# EAGLE design SomTest1 (EAGLE 9.4.0)
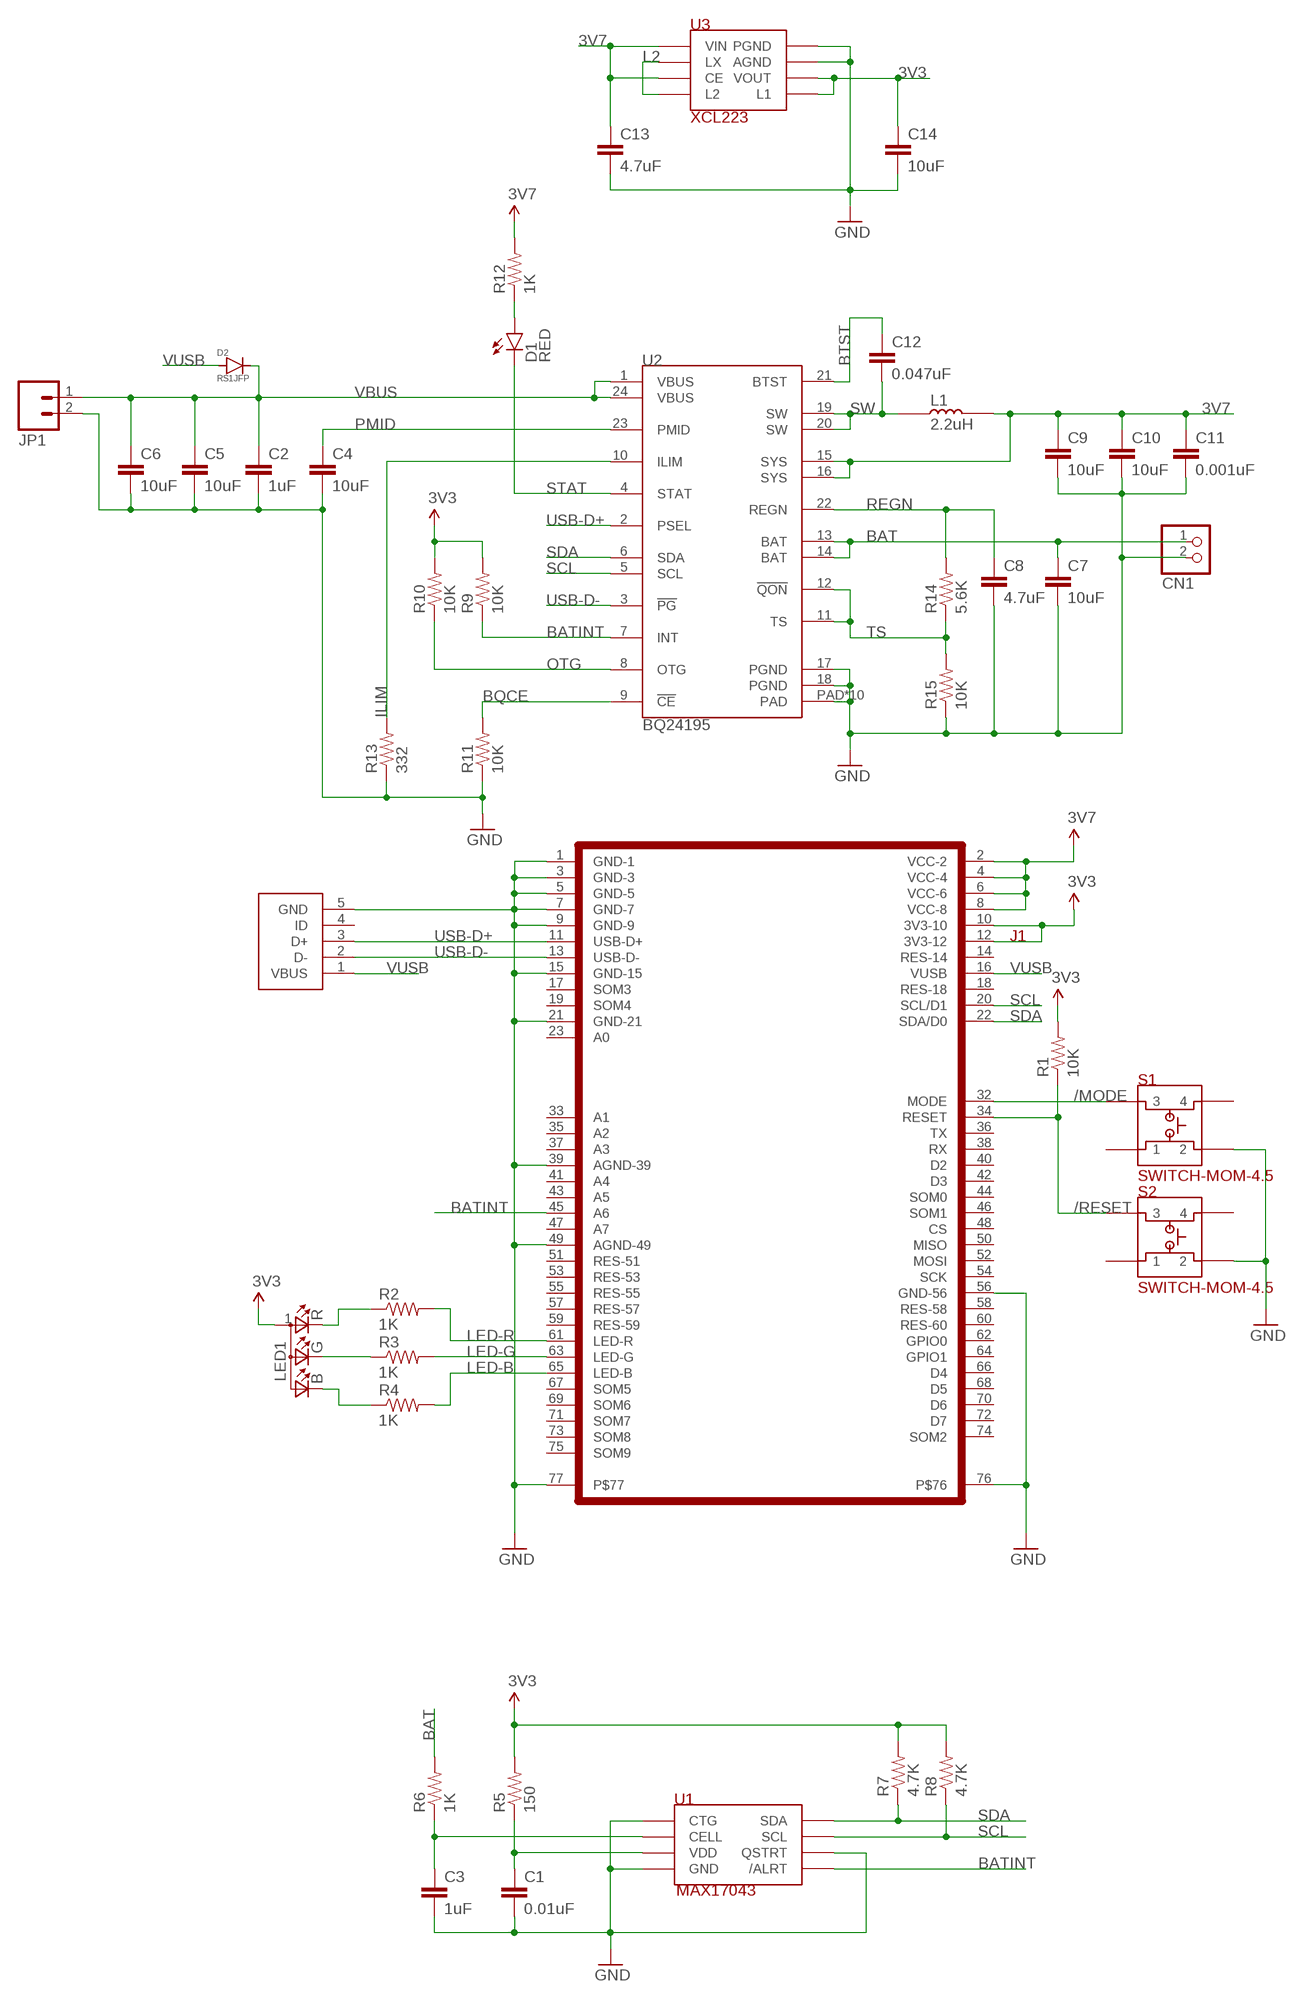
[diagram p0: schematic, sheet 1]

## Parts
C1  0.01uF  CAP-0.01UF-0603  [0603-CAP]
C2  1uF  CAP-1UF-0603.DEV  [0603-CAP]
C3  1uF  CAP-1UF-0603.DEV  [0603-CAP]
C4  10uF  CAP-10UF-0603  [0603-CAP]
C5  10uF  CAP-10UF-0603  [0603-CAP]
C6  10uF  CAP-10UF-0603  [0603-CAP]
C7  10uF  CAP-10UF-0603  [0603-CAP]
C8  4.7uF  CAP-4.7UF-0603  [0603-CAP]
C9  10uF  CAP-10UF-0603  [0603-CAP]
C10  10uF  CAP-10UF-0603  [0603-CAP]
C11  0.001uF  CAP-0.001UF-0603  [0603-CAP]
C12  0.047uF  CAP-0.047UF-0603  [0603-CAP]
C13  4.7uF  CAP-4.7UF-0603  [0603-CAP]
C14  10uF  CAP-10UF-0603  [0603-CAP]
CN1  JST_2PIN-THM  [JST-PH-2-THM]
D1  RED  LED-RED  [LED-0603]
D2  RS1JFP  DIODE-RS1JFP  [SOD-123HE-ON]
J1  SPARK_M.2EKEY  [SPARK_M.2EKEY-LESS-CREAM]
JP1  M02PTH  [1X02]
L1  2.2uH  INDUCTOR-2.2UH  [1008-BOURNS]
LED1  LED-RGB-CREE-SMD  [LED-RGB-CREE-SMD]
R1  10K  RES-10K-06030603  [0603-RES]
R2  1K  RES-1K-0603  [0603-RES]
R3  1K  RES-1K-0603  [0603-RES]
R4  1K  RES-1K-0603  [0603-RES]
R5  150  RES-150-0603  [0603-RES]
R6  1K  RES-1K-0603  [0603-RES]
R7  4.7K  RES-4.7K-0603  [0603-RES]
R8  4.7K  RES-4.7K-0603  [0603-RES]
R9  10K  RES-10K-06030603  [0603-RES]
R10  10K  RES-10K-06030603  [0603-RES]
R11  10K  RES-10K-06030603  [0603-RES]
R12  1K  RES-1K-0603  [0603-RES]
R13  332  RES-332-0603.DEV  [0603-RES]
R14  5.6K  RES-5.6K-0603  [0603-RES]
R15  10K  RES-10K-06030603  [0603-RES]
S1  SWITCH-MOM-4.5  [SWITCH-MOM-4.5]
S2  SWITCH-MOM-4.5  [SWITCH-MOM-4.5]
U1  MAX17043  [9UCSP-MAXIM]
U2  BQ24195  [24VFQN-TI]
U3  XCL223  REG-XCL223  [REG-XCL223-LESS-CREAM]
U$3  USB-MICRO-B-SOCKET-AMPHENOL  [USB-B-SMT-AMPHENOL]

## Nets
3V3: C14.1 J1.10(3V3-10) J1.12(3V3-12) LED1.1(A) R1.2 R5.2 R7.2 R8.2 R9.2 R10.2 U3.3(VOUT) U3.7(L1)
3V7: C9.1 C10.1 C11.1 C13.1 J1.2(VCC-2) J1.4(VCC-4) J1.6(VCC-6) J1.8(VCC-8) L1.2 R12.2 U2.15(SYS) U2.16(SYS) U3.4(CE) U3.6(VIN)
/MODE: J1.32(MODE) S1.3
/RESET: J1.34(RESET) R1.1 S2.3
BAT: C7.1 CN1.1 R6.2 U2.13(BAT) U2.14(BAT)
BATINT: J1.45(A6) R9.1 U1.C1(/ALRT) U2.7(INT)
BQCE: R11.2 U2.9(!CE)
BTST: C12.1 U2.21(BTST)
GND: C1.2 C2.2 C3.2 C4.2 C5.2 C6.2 C7.2 C8.2 C9.2 C10.2 C11.2 C13.2 C14.2 CN1.2 J1.1(GND-1) J1.3(GND-3) J1.5(GND-5) J1.7(GND-7) J1.9(GND-9) J1.15(GND-15) J1.21(GND-21) J1.39(AGND-39) J1.49(AGND-49) J1.56(GND-56) J1.76 J1.77 JP1.2 R11.1 R13.1 R15.1 S1.2 S2.2 U1.A3(CTG) U1.B1(QSTRT) U1.C3(GND) U2.17(PGND) U2.18(PGND) U2.PAD U2.PAD@1(PAD) U2.PAD@2(PAD) U2.PAD@3(PAD) U2.PAD@4(PAD) U2.PAD@5(PAD) U2.PAD@6(PAD) U2.PAD@7(PAD) U2.PAD@8(PAD) U2.PAD@9(PAD) U3.1(PGND) U3.2(AGND) U$3.5(GND)
ILIM: R13.2 U2.10(ILIM)
L2: U3.5(LX) U3.8(L2)
LED-B: J1.65(LED-B) R4.2
LED-G: J1.63(LED-G) R3.2
LED-R: J1.61(LED-R) R2.2
N$2: LED1.3(G) R3.1
N$3: C3.1 R6.1 U1.B3(CELL)
N$5: C1.1 R5.1 U1.C2(VDD)
N$6: LED1.4(R) R2.1
N$7: D1.A R12.1
N$10: LED1.2(B) R4.1
OTG: R10.1 U2.8(OTG)
PMID: C4.1 U2.23(PMID)
REGN: C8.1 R14.2 U2.22(REGN)
SCL: J1.20(SCL/D1) R8.1 U1.A2(SCL) U2.5(SCL)
SDA: J1.22(SDA/D0) R7.1 U1.A1(SDA) U2.6(SDA)
STAT: D1.C U2.4(STAT)
SW: C12.2 L1.1 U2.19(SW) U2.20(SW)
TS: R14.1 R15.2 U2.11(TS) U2.12(!QON)
USB-D+: J1.11(USB-D+) U2.2(PSEL) U$3.3(D+)
USB-D-: J1.13(USB-D-) U2.3(!PG) U$3.2(D-)
VBUS: C2.1 C5.1 C6.1 D2.1(CATHODE) JP1.1 U2.1(VBUS) U2.24(VBUS)
VUSB: D2.2(ANODE) J1.16(VUSB) U$3.1(VBUS)
Unconnected: J1.14(RES-14) J1.17(SOM3) J1.18(RES-18) J1.19(SOM4) J1.23(A0) J1.33(A1) J1.35(A2) J1.36(TX) J1.37(A3) J1.38(RX) J1.40(D2) J1.41(A4) J1.42(D3) J1.43(A5) J1.44(SOM0) J1.46(SOM1) J1.47(A7) J1.48(CS) J1.50(MISO) J1.51(RES-51) J1.52(MOSI) J1.53(RES-53) J1.54(SCK) J1.55(RES-55) J1.57(RES-57) J1.58(RES-58) J1.59(RES-59) J1.60(RES-60) J1.62(GPIO0) J1.64(GPIO1) J1.66(D4) J1.67(SOM5) J1.68(D5) J1.69(SOM6) J1.70(D6) J1.71(SOM7) J1.72(D7) J1.73(SOM8) J1.74(SOM2) J1.75(SOM9) S1.1 S1.4 S2.1 S2.4 U$3.4(ID)

## Library data of the parts
C1 = rickk2:CAP-0.01UF-0603: CAP CER 10000PF 100V X7R 0603 10000 pF = 10 nF = 0.01 uF https://www.digikey.com/product-detail/en/murata-electronics-north-america/GCM188R72A103KA37J/490-8028-1-ND/4380313
C2 C3 = rickk2:CAP-1UF-0603.DEV: CAP CER 1UF 25V X7R 0603 $ 0.10 Samsung CL10B105KA8NNNC https://www.digikey.com/product-detail/en/samsung-electro-mechanics-america-inc/CL10B105KA8NNNC/1276-1184-1-ND/3889270 1µF ±10% 25V Ceramic Capacitor X7R 0603 (1608 Metric)
C4-C7 C9 C10 C14 = rickk2:CAP-10UF-0603: CAP CER 10UF 16V X5R 0805 $ 0.21 https://www.digikey.com/product-detail/en/murata-electronics-north-america/GRM21BR61C106KE15L/490-3886-1-ND/965928
C8 C13 = rickk2:CAP-4.7UF-0603: Murata X5R series CAP CER 4.7UF 6.3V X5R 0603 $0.12 https://www.digikey.com/product-detail/en/murata-electronics-north-america/GRM188R60J475KE19J/490-6407-1-ND/3845604
C11 = rickk2:CAP-0.001UF-0603: 0.001uF / 1 nF / 1000 pF cap $0.10 **not ordered yet** Murata Electronics North America GRM1885C1H102JA01D CAP CER 1000PF 50V C0G/NP0 0603 1000pF ±5% 50V Ceramic Capacitor C0G, NP0 0603 (1608 Metric) https://www.digikey.com/product-detail/en/murata-electronics-north-america/GRM1885C1H102JA01D/490-1451-1-ND/587655
C12 = rickk2:CAP-0.047UF-0603: 0.047uF / 47 nF cap $0.30 **not ordered yet** Murata Electronics North America GCJ188R71H473KA12D CAP CER 0.047UF 50V X7R 0603 0.047µF ±10% 50V Ceramic Capacitor X7R 0603 (1608 Metric) https://www.digikey.com/product-detail/en/murata-electronics-north-america/GCJ188R71H473KA12D/490-5854-1-ND/2785840
CN1 = rickk2:JST_2PIN: JST 2-Pin Connectors of various flavors SMT-RA (S2B-PH-SM4) 4UConnector #17311 SMT (B2B-PH-SM4) THM-RA (S2B-PH) THM (B2B-PH) 1=+ 2=- THM: CONN HEADER PH TOP 2POS 2MM $0.17 B2B-PH-K-S(LF)(SN) https://www.digikey.com/product-detail/en/jst-sales-america-inc/B2B-PH-K-S-LF-SN/455-1704-ND/926611
D1 = rickk2:LED-RED: LED RED CLEAR 0603 SMD $0.41 Red 631nm LED Indication - Discrete 2V 0603 (1608 Metric) 5mA@2V https://www.digikey.com/product-detail/en/lite-on-inc/LTST-C193KRKT-5A/160-1830-1-ND/2356251 Res = 270 ohm @ 3.3V Res = 680 ohm 1/8W @ 5V Res = 2.2K 1/8W @ 12V
D2 = rickk2:DIODE-RS1JFP: Reverse voltage protection diode - not ordered yet! ON Semiconductor RS1JFP $0.44 DIODE GP 600V 1.2A SOD123HE Diode Standard 600V 1.2A Surface Mount SOD-123HE https://www.digikey.com/product-detail/en/on-semiconductor/RS1JFP/RS1JFPCT-ND/5722970 Used in Ford open power supply 1=Cathode=Large Pad=side with band 2=Anode=Small Pad
J1 = rickk2:SPARK_M.2EKEY: $1.42 CONN FEMALE 67POS 0.020 GOLD TE Connectivity AMP Connectors 2199230-4 https://www.digikey.com/product-detail/en/te-connectivity-amp-connectors/2199230-4/A115904CT-ND/4208916
JP1 = rickk2:M02: Standard 2-pin 0.1" header. Use with - straight break away headers ( PRT-00116) - right angle break away headers (PRT-00553) - swiss pins (PRT-00743) - machine pins (PRT-00117) - female headers (PRT-00115) Molex polarized connector foot print use with: PRT-08233 with associated crimp pins and housings. 2.54_SCREWTERM for use with PRT-10571. 3.5mm Screw Terminal footprints for PRT-08084 5mm Screw Terminal footprints for use with PRT-08432
L1 = rickk2:INDUCTOR-2.2UH: 2.2uH inductor $0.31 **not ordered yet** Bourns Inc. SRN2512-2R2M FIXED IND 2.2UH 2.3A 102 MOHM 2.2µH Semi-Shielded Wirewound Inductor 2.3A 102 mOhm Max 1008 (2520 Metric) https://www.digikey.com/product-detail/en/bourns-inc/SRN2512-2R2M/SRN2512-2R2MCT-ND/4867759
LED1 = rickk2:LED-RGB-CREE-SMD: LED RGB DIFFUSED 4SMD $ 0.35 Cree CLMVB-FKA-CFHEHLCBB7A363 2mm 4-PLCC common anode RGB LED https://www.digikey.com/product-detail/en/cree-inc/CLMVB-FKA-CFHEHLCBB7A363/CLMVB-FKA-CFHEHLCBB7A363CT-ND/6138627 Red=68 ohm, Green/Blue=33 ohm @ 3.3V
R1 R9-R11 R15 = rickk2:RES-10K-0603: RES SMD 10K OHM 5% 1/4W 0603 $ 0.10 https://www.digikey.com/product-detail/en/panasonic-electronic-components/ERJ-PA3J103V/P10KBZCT-ND/5036237
R2-R4 R6 R12 = rickk2:RES-1K-0603: RES SMD 1K OHM 0.5% 1/5W 0603 $ 0.17 https://www.digikey.com/product-detail/en/panasonic-electronic-components/ERJ-PB3D1001V/P20283CT-ND/6214538 Panasonic
R5 = rickk2:RES-150-0603: Panasonic Electronic Components ERJ-3EKF1500V $0.10 **not ordered yet** RES SMD 150 OHM 1% 1/10W 0603 150 Ohms ±1% 0.1W, 1/10W Chip Resistor 0603 (1608 Metric) Automotive AEC-Q200 Thick Film https://www.digikey.com/product-detail/en/panasonic-electronic-components/ERJ-3EKF1500V/P150HCT-ND/198177
R7 R8 = rickk2:RES-4.7K-0603: RES SMD 4.7K OHM 5% 1/4W 0603 $ 0.11 https://www.digikey.com/product-detail/en/panasonic-electronic-components/ERJ-PA3J472V/P4.7KBZCT-ND/5036332 Panasonic
R13 = rickk2:RES-332-0603.DEV: Panasonic SMD 0603 1% 1/10W https://www.digikey.com/product-detail/en/panasonic-electronic-components/ERJ-3EKF3320V/P332HCT-ND/198336
R14 = rickk2:RES-5.6K-0603: Panasonic Electronic Components ERJ-3EKF5601V $0.10 **not ordered yet** RES SMD 5.6K OHM 1% 1/10W 0603 5.6 kOhms ±1% 0.1W, 1/10W Chip Resistor 0603 (1608 Metric) Automotive AEC-Q200 Thick Film https://www.digikey.com/product-detail/en/panasonic-electronic-components/ERJ-3EKF5601V/P5.60KHCT-ND/1746792
S1 S2 = rickk2:SWITCH-MOM-4.5: Manufacturer: E-Switch Manufacturer Part Number: TL3305AF160QG Description: SWITCH TACTILE SPST-NO 50MA 12V Detailed Description: Tactile Switch SPST-NO Top Actuated Surface Mount $0.20 https://www.digikey.com/product-detail/en/e-switch/TL3305AF160QG/EG5350CT-ND/5816195
U1 = rickk2:MAX17043: MAX17043X+T10 9-UCSP (W91C1+1) package https://www.mouser.com/ProductDetail/Maxim-Integrated/MAX17043X%2bT10?qs=sGAEpiMZZMtKiEBa%2FXu9%252BOav9R4qKwGZ Connect CTG and QSTRT to GND. /ALRT is output can leave unconnected.
U2 = rickk2:BQ24195: Texas Instruments BQ24195LRGER $2.93 IC CHRG MGMT LI-ION/POL 24VQFN Charger IC Lithium-Ion/Polymer 24-VQFN (4x4) https://www.digikey.com/product-detail/en/texas-instruments/BQ24195LRGER/296-49149-1-ND/9351369
U3 = rickk2:REG-XCL223: Manufacturer: Torex Semiconductor Ltd Manufacturer Part Number: XCL223A333D2-G DC DC CONVERTER 3.3V Detailed Description: Non-Isolated PoL Modul $2.63 https://www.digikey.com/product-detail/en/torex-semiconductor-ltd/XCL223A333D2-G/893-1416-1-ND/8256118 CIN=4.7uF 10V CL = 10uF 10V VIN MAX=5.5V VOUT=3.3V
U$3 = rickk2:USB-MICRO-B-SOCKET-AMPHENOL: CONN USB MICRO B RECPT SMT R/A $0.42 Amphenol FCI 10118194-0001LF https://www.digikey.com/products/en?keywords=609-4618-1-nd

## Board
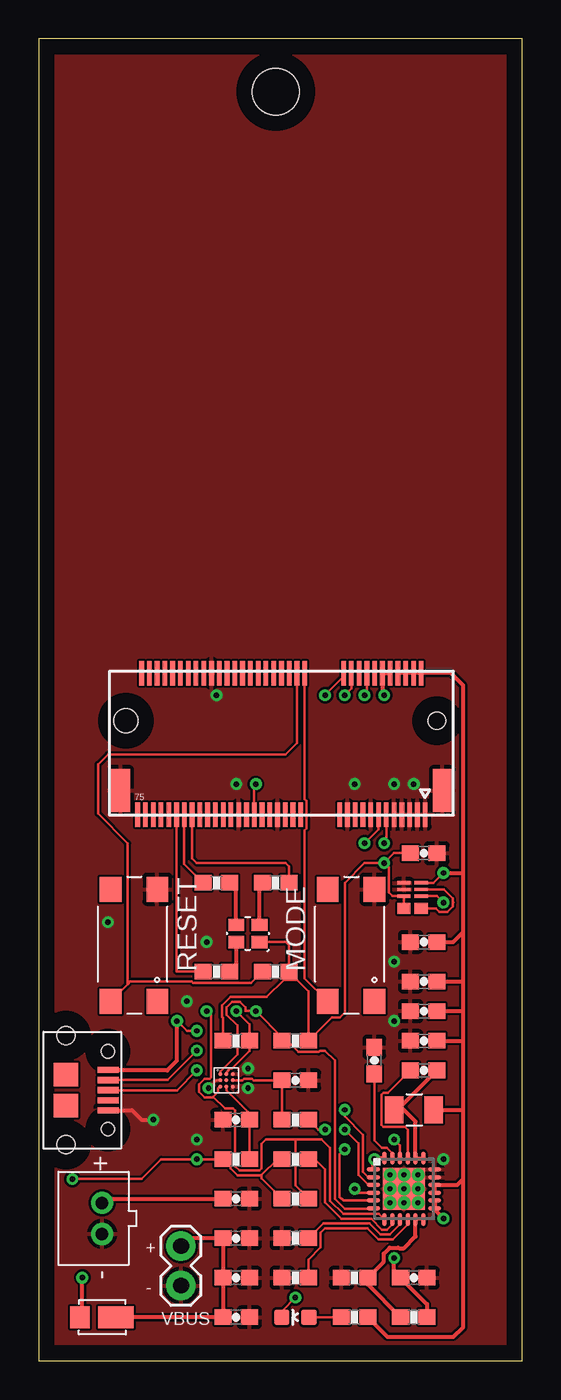
[diagram p1: board, top side]
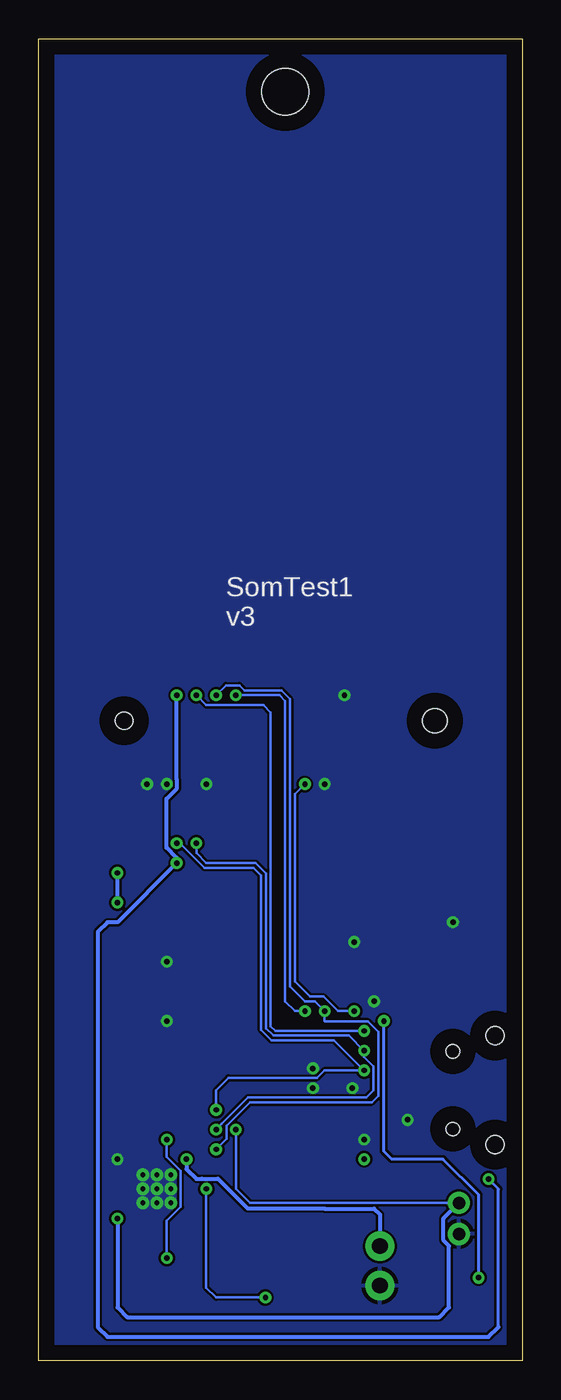
[diagram p2: board, bottom side, seen from below]

Size 31.09 x 85.01 mm. Coordinates in mm from the lower left corner, seen from the top.
Outline: 0,0 31.09,0 31.09,85.01 0,85.01 0,0
Copper layers (1*16): Top 0.035mm / dielectric 1.5mm / Bottom 0.035mm
Design rules "default": minimum track width 6mil, minimum drill 0.35mm, track to track 6mil, track to pad 6mil, pad to pad 6mil, via to via 6mil, smd to smd 6mil, copper to edge 40mil, drill to drill 6mil, minimum pad ring 10mil, minimum via ring 8mil, stop-mask expansion 4mil, vias tented up to drill 0mil, thermal gap 10mil
Holes 3 mm at 15.24,81.62

### Footprints (pad centres in the part's own frame; a part is rotated, then mirrored left to right if it is on the bottom)
0603-CAP = smd 1.1 x 1: 1 -0.85,0; 2 0.85,0
JST-PH-2-THM = drill 0.8 pad 1.422: 1 1,0; 2 -1,0
LED-0603 = smd 1 x 1: A 0,-0.877; C 0,0.877
SOD-123HE-ON = smd 2.3 x 1.4: 1 -0.9,0 | smd 1.25 x 1.4: 2 1.425,0
SPARK_M.2EKEY-LESS-CREAM = smd 0.3 x 1.55: 1 -9.62,4.51; 2 -9.37,-4.59; 3 -9.12,4.51; 4 -8.87,-4.59; 5 -8.62,4.51; 6 -8.37,-4.59; 7 -8.12,4.51; 8 -7.87,-4.59; 9 -7.62,4.51; 10 -7.37,-4.59; 11 -7.12,4.51; 12 -6.87,-4.59; 13 -6.62,4.51; 14 -6.37,-4.59; 15 -6.12,4.51; 16 -5.87,-4.59; 17 -5.62,4.51; 18 -5.37,-4.59; 19 -5.12,4.51; 20 -4.87,-4.59; 21 -4.62,4.51; 22 -4.37,-4.59; 23 -4.12,4.51; 32 -1.87,-4.59; 33 -1.62,4.51; 34 -1.37,-4.59; 35 -1.12,4.51; 36 -0.87,-4.59; 37 -0.62,4.51; 38 -0.37,-4.59; 39 -0.12,4.51; 40 0.13,-4.59; 41 0.38,4.51; 42 0.63,-4.59; 43 0.88,4.51; 44 1.13,-4.59; 45 1.38,4.51; 46 1.63,-4.59; 47 1.88,4.51; 48 2.13,-4.59; 49 2.38,4.51; 50 2.63,-4.59; 51 2.88,4.51; 52 3.13,-4.59; 53 3.38,4.51; 54 3.63,-4.59; 55 3.88,4.51; 56 4.13,-4.59; 57 4.38,4.51; 58 4.63,-4.59; 59 4.88,4.51; 60 5.13,-4.59; 61 5.38,4.51; 62 5.63,-4.59; 63 5.88,4.51; 64 6.13,-4.59; 65 6.38,4.51; 66 6.63,-4.59; 67 6.88,4.51; 68 7.13,-4.59; 69 7.38,4.51; 70 7.63,-4.59; 71 7.88,4.51; 72 8.13,-4.59; 73 8.38,4.51; 74 8.63,-4.59; 75 8.88,4.51 | smd 1.2 x 2.75: 76 9.98,2.96; 77 -10.72,2.96 | hole 1.1: -10.37,-1.54 | hole 1.55: 9.63,-1.54
1X02 = drill 1.016 pad 1.88: 1 0,0; 2 2.54,0
1008-BOURNS = smd 1.2 x 1.75: 1 0,0; 2 2.55,0
LED-RGB-CREE-SMD = smd 1 x 0.8: 1 1.5,0; 2 0,0; 3 0,1.1; 4 1.5,1.1
0603-RES = smd 1.1 x 1: 1 -0.85,0; 2 0.85,0
SWITCH-MOM-4.5 = smd 1.6 x 1.4: 1 0,0; 2 7.2,0; 3 0,3; 4 7.2,3
9UCSP-MAXIM = smd 0.27 x 0.27: A1 -0.4,0.4; A2 0,0.4; A3 0.4,0.4; B1 -0.4,0; B2 0,0; B3 0.4,0; C1 -0.4,-0.4; C2 0,-0.4; C3 0.4,-0.4
24VFQN-TI = smd 0.85 x 0.28: 1 -1.975,1.25; 2 -1.975,0.75; 3 -1.975,0.25; 4 -1.975,-0.25; 5 -1.975,-0.75; 6 -1.975,-1.25; 13 1.975,-1.25; 14 1.975,-0.75; 15 1.975,-0.25; 16 1.975,0.25; 17 1.975,0.75; 18 1.975,1.25 | smd 0.28 x 0.85: 7 -1.25,-1.975; 8 -0.75,-1.975; 9 -0.25,-1.975; 10 0.25,-1.975; 11 0.75,-1.975; 12 1.25,-1.975; 19 1.25,1.975; 20 0.75,1.975; 21 0.25,1.975; 22 -0.25,1.975; 23 -0.75,1.975; 24 -1.25,1.975 | smd 2.7 x 2.7: PAD 0,0 | drill 0.3 pad 0.406: PAD@1 -0.9,0.9; PAD@2 0,0.9; PAD@3 0.9,0.9; PAD@4 -0.9,0; PAD@5 0,0; PAD@6 0.9,0; PAD@7 -0.9,-0.9; PAD@8 0,-0.9; PAD@9 0.9,-0.9
REG-XCL223-LESS-CREAM = smd 0.85 x 0.21: 1 0,0; 2 0,0.43; 3 0,0.86; 4 -1.11,0.86; 5 -1.11,0.43; 6 -1.11,0 | smd 0.85 x 0.7: 7 0,1.655; 8 -1.11,1.655
USB-B-SMT-AMPHENOL = smd 0.4 x 1.35: 1 -1.3,0; 2 -0.65,0; 3 0,0; 4 0.65,0; 5 1.3,0 | smd 1.5 x 1.55: P$6 -1,-2.7; P$7 1,-2.7 | hole 0.85: -2.5,0; 2.5,0 | hole 1.15: -3.5,-2.7; 3.5,-2.7

### Placement (x,y rotation side)
C1  12.7,15.49 180 top
C2  12.7,5.33 0 top
C3  16.51,18.03 0 top
C4  21.59,19.3 90 top
C5  12.7,2.79 0 top
C6  12.7,7.87 0 top
C7  12.7,10.41 0 top
C8  24.13,5.33 0 top
C9  24.77,24.38 180 top
C10  24.77,22.48 180 top
C11  24.77,20.57 180 top
C12  24.77,18.67 0 top
C13  24.77,26.92 180 top
C14  24.77,32.64 0 top
CN1  4.06,9.14 90 top
D1  16.51,2.79 90 top
D2  4.06,2.79 180 top
J1  15.24,39.62 180 top
JP1  9.14,7.37 270 top
L1  22.86,16.13 0 top
LED1  12.7,26.92 0 top
R1  15.24,25.02 0 top
R2  15.24,30.73 0 top
R3  11.43,30.73 180 top
R4  11.43,25.02 180 top
R5  12.7,12.95 180 top
R6  16.51,15.49 0 top
R7  16.51,20.57 0 top
R8  12.7,20.57 180 top
R9  16.51,10.41 180 top
R10  16.51,12.95 180 top
R11  16.51,7.87 0 top
R12  20.32,2.79 0 top
R13  16.51,5.33 0 top
R14  24.13,2.79 0 top
R15  20.32,5.33 0 top
S1  21.59,23.11 90 top
S2  7.62,23.11 90 top
U1  12.06,18.03 0 top
U2  23.5,11.05 0 top
U3  23.5,30.73 180 top
U$3  4.45,17.4 270 top

### Tracks (layer width: path | path; a pad name or v marks a point on that pad's centre or on a via)
3V3  (via drill 0.35)
  Top 0.152: LED1.1 15.88,26.92 16.09,26.71 R1.2 16.62,24.49 | 16.62,24.49 17.36,23.75 R7.2 18.87,22.09 19.39,22.09 19.68,22.39 19.68,30.73 20.95,32 v22.23,32 | 16.62,24.49 15.77,24.49 14.67,23.39 12.32,23.39 11.79,22.86 11.79,22.1 11.85,22.04 R8.2 | v22.23,32 22.86,32.64 C14.1 | U3.7 U3.3 22.74,29.87 22.52,30.1 22.52,31.71 v22.23,32 | R10.2 15.35,12.95 14.35,11.94 | 14.35,11.94 14.32,11.92 12.78,11.92 12.32,12.38 12.32,12.48 R5.2 v10.16,12.95 7.87,12.95 6.6,11.68 v2.16,11.68 | R9.2 14.35,11.73 14.35,11.94
  Top 0.254: v22.23,42.8 22.11,42.91 J1.12 J1.10
  Bottom 0.203: 1.52,2.16 1.52,11.05 v2.16,11.68
  Bottom 0.254: v22.23,42.8 22.23,37.38 22.2,37.36 22.2,36.81 22.88,36.13 22.88,33 22.23,32.34 v22.23,32 26.04,28.19 26.67,28.19 27.3,27.56 27.3,2.16 26.67,1.52 2.16,1.52 1.52,2.16
3V7  (via drill 0.35)
  Top 0.152: U3.4 25.62,29.87 v26.04,29.46 | U3.6 25.4,30.73 v26.04,31.37
  Top 0.254: 27.3,27.56 27.3,31.37 | 27.3,31.37 27.3,43.43 26.52,44.21 J1.2 J1.4 J1.6 J1.8 | C13.1 26.67,26.92 27.3,27.56 | v26.04,31.37 27.3,31.37 | U2.15 U2.16 26.92,11.3 27.3,11.68 | 27.3,11.68 27.3,16.13 | 27.3,16.13 27.3,20.57 | 27.3,20.57 27.3,22.48 | 27.3,22.48 27.3,24.38 | 27.3,24.38 27.3,27.56 | C9.1 27.3,24.38 | C10.1 27.3,22.48 | C11.1 27.3,20.57 | L1.2 27.3,16.13 | R12.2 22.44,1.52 26.67,1.52 27.3,2.16 27.3,11.68
  Bottom 0.254: v26.04,29.46 v26.04,31.37
/MODE
  Top 0.152: S1.3 17.11,24.59 17.11,34.12 17.24,34.24 17.24,35.98 17.11,36.11 J1.32
/RESET
  Top 0.152: 5.71,24.21 5.71,33.27 3.81,35.18 3.81,38.35 4.45,38.99 15.88,38.99 16.61,39.72 J1.34 | 5.71,24.21 5.89,24.38 9.84,24.38 9.94,24.29 13.66,24.29 R1.1 | S2.3 5.71,24.21
BAT  (via drill 0.35)
  Top 0.152: v18.41,14.86 18,14.86 R6.2
  Top 0.254: CN1.1 4.33,10.41 C7.1 | U2.14 U2.13 25.47,9.71 v26.04,9.14
  Bottom 0.152: v18.41,14.86 18.41,11.05 17.51,10.14 CN1.1
  Bottom 0.254: v26.04,9.14 26.04,3.43 25.4,2.79 5.33,2.79 4.7,3.43 4.7,7.38 5.05,7.73 5.05,9.15 CN1.1
BATINT  (via drill 0.35)
  Top 0.152: 11.22,16.97 11.53,17.28 11.53,17.5 U1.C1 | 11.22,16.97 11.17,16.92 10.67,16.92 10.31,17.28 10.31,17.78 10.67,18.13 10.98,18.13 11.07,18.23 11.07,22.2 v10.79,22.48 | 11.22,16.97 11.97,16.22 12.49,16.22 12.63,16.09 12.63,12.5 12.9,12.22 14.2,12.22 14.33,12.36 14.33,13.95 14.61,14.22 16.51,14.22 | 16.51,14.22 18.19,14.22 18.75,13.67 18.75,10.29 19.6,9.43 21.89,9.43 U2.7 | R9.1 16.51,11.26 16.51,14.22 | J1.45 13.86,36.97 v13.97,37.08
  Bottom 0.152: v10.79,22.48 11.84,22.48 12.78,23.42 13.64,23.42 14.61,24.38 14.61,36.45 v13.97,37.08
BQCE
  Top 0.152: R11.2 18.31,8.82 21.26,8.82 21.97,8.12 22.59,8.12 23.25,8.77 U2.9
BTST
  Top 0.152: U2.21 23.75,14.83 23.55,15.03 22.16,15.03 22.03,15.16 22.03,17.1 22.16,17.23 22.48,17.23 C12.1
GND  (via drill 0.35)
  Top 0.152: v10.92,17.53 11.43,18.03 U1.B1
  Top 0.254: U$3.5 6,16.1 6.6,15.49 v7.37,15.49
  other vias: 22.86,37.08 4.45,28.19 10.79,26.92 11.43,42.8 24.13,37.08 20.32,37.08 9.53,23.11 13.46,18.8 13.46,17.53 26.04,12.95 22.86,21.84 22.86,25.65 10.16,14.22 12.7,37.08
  pour Top: 0,-0.76 0,87.12 32.26,87.12 32.26,-0.76
  pour Bottom: 0,-2.29 0,86.36 32.26,86.36 32.26,-2.29
ILIM
  Top 0.152: R13.2 17.36,6.5 18.14,7.28 18.14,8.22 18.43,8.51 21.14,8.51 21.84,7.81 22.79,7.81 23.75,8.77 U2.10
L2
  Top 0.152: U3.8 25.56,29.08 25.78,28.86 26.29,28.86 26.64,29.21 26.64,29.44 26.67,29.46 26.64,29.49 26.64,29.71 26.05,30.3 U3.5
LED-B
  Top 0.152: R4.2 8.89,25.02 8.86,25.05 J1.65
LED-G
  Top 0.152: R3.2 9.36,31.95 J1.63
LED-R
  Top 0.152: R2.2 16.09,31.79 15.88,32 10.16,32 9.86,32.3 J1.61
N$2
  Top 0.254: LED1.3 12.7,30.31 R3.1
N$3
  Top 0.152: U1.B3 13.11,18.03 13.21,18.13 13.71,18.13 13.81,18.03 C3.1 R6.1
N$5
  Top 0.152: U1.C2 12.06,17.4 13.55,15.91 C1.1 R5.1
N$6
  Top 0.254: LED1.4 14.2,30.54 R2.1
N$7
  Top 0.152: D1.A R12.1
N$10
  Top 0.254: LED1.2 12.7,25.44 R4.1
OTG
  Top 0.152: U2.8 22.75,8.77 22.4,8.42 22.09,8.42 21.39,9.13 19.48,9.13 18.41,10.19 18.41,12.32 17.78,12.95 R10.1
PMID
  Top 0.152: C4.1 21.59,14.18 22.09,13.68 22.4,13.68 22.75,13.33 U2.23
REGN  (via drill 0.35)
  Top 0.152: U2.22 23.25,13.84 v22.86,14.22
  Top 0.254: v22.86,6.6 22.86,5.75 C8.1 24.98,3.63 R14.2
  Bottom 0.152: v22.86,6.6 22.86,8.99 21.96,9.89 21.96,12.21 22.86,13.11 v22.86,14.22
SCL  (via drill 0.35)
  Top 0.152: v12.7,22.48 13.55,21.63 R8.1 13.55,19.92 12.43,18.8 12.31,18.8 12.1,18.59 12.1,18.47 U1.A2 | v19.68,13.59 19.36,13.26 19.36,10.54 19.6,10.3 U2.5 | J1.20 20.11,43.22 v19.68,42.8
  Bottom 0.152: v19.68,13.59 19.02,14.25 19.02,15.11 17.52,16.61 9.68,16.61 9.25,17.04 9.25,21.16 9.91,21.82 12.67,21.82 12.7,21.84 v12.7,22.48 13.34,23.11 13.97,23.11 14.94,24.08 14.94,42.54 15.49,43.1 17.86,43.1 18.19,43.43 19.05,43.43 v19.68,42.8
SDA  (via drill 0.35)
  Top 0.152: U1.A1 11.7,18.47 11.7,18.62 12.77,19.69 12.77,21.55 12.09,22.23 12.09,22.73 12.45,23.09 12.95,23.09 13.31,22.73 13.31,22.51 13.34,22.48 v13.97,22.48 15.66,20.79 R7.1 15.99,20.57 16.71,19.85 18,19.85 18.1,19.94 18.41,19.94 19.05,19.3 19.05,10.41 19.68,9.78 21.5,9.78 U2.6 | J1.22 19.61,43.99 v18.41,42.8
  Bottom 0.152: v13.97,22.48 14.61,22.48 15.24,23.11 15.24,42.42 15.62,42.8 v18.41,42.8
STAT  (via drill 0.35)
  Top 0.152: U2.4 20.57,10.8 v20.32,11.05 | D1.C 15.63,3.19 v16.51,4.06
  Bottom 0.152: v16.51,4.06 19.68,4.06 20.32,4.7 v20.32,11.05
SW
  Top 0.254: U2.19 U2.20 24.25,15.38 23.5,16.13 L1.1 23.07,16.13 C12.2
TS
  Top 0.152: U2.11 U2.12
  Top 0.254: R14.1 21.17,4.9 R15.2 22.2,6.37 22.2,6.88 22.59,7.26 23.13,7.26 23.16,7.24 23.5,7.24 24.25,7.99 U2.11
USB-D+  (via drill 0.35)
  Top 0.152: J1.11 22.36,33.41 v22.23,33.27 | U$3.3 8.89,17.4 v10.16,18.67 | U2.2 21.21,11.8 20.87,12.15 20.87,14.54 19.68,15.72 v19.68,16.13
  Bottom 0.152: v22.23,33.27 22.02,33.27 20.45,31.7 17.27,31.7 16.79,31.21 16.79,21.26 16.13,20.6 12.09,20.6 v10.16,18.67 12.73,18.67 13.21,18.19 18.89,18.19 19.68,17.4 v19.68,16.13
USB-D-  (via drill 0.35)
  Top 0.152: J1.13 21.86,34.18 v20.95,33.27 | U$3.2 8.27,18.05 v10.16,19.94 | U2.3 21.21,11.3 20.56,11.95 20.56,13.98 v19.68,14.86
  Bottom 0.152: v20.95,33.27 20.95,32.64 20.32,32 17.14,32 16.48,31.34 16.48,21.39 16,20.9 11.12,20.9 v10.16,19.94 10.16,19.53 9.55,18.92 9.55,17.37 10.01,16.92 17.64,16.92 19.33,15.24 19.33,15.22 v19.68,14.86
VBUS  (via drill 0.35)
  Top 0.254: U2.24 21.66,13.02 v21.59,12.95 21.52,12.88 U2.1 | D2.1 C5.1 C2.1 C6.1 9.65,7.87 JP1.1
  Bottom 0.254: v21.59,12.95 21.59,12.32 20.95,11.68 20.61,11.68 20.59,11.71 19.58,11.71 17.66,9.79 12.71,9.79 12.7,9.78 9.53,9.78 9.14,9.4 JP1.1
VUSB  (via drill 0.35)
  Top 0.152: v20.95,42.8 21.11,42.95 J1.16 | v10.16,21.21 9.53,21.21 v8.89,21.84
  Top 0.254: D2.2 2.79,2.95 v2.79,5.33 | U$3.1 8.22,18.7 8.26,18.67 8.89,19.3 v8.89,21.84
  Bottom 0.152: v10.16,21.21 15.88,21.21 16.18,21.51 16.18,41.7 16.64,42.16 20.32,42.16 v20.95,42.8
  Bottom 0.203: v2.79,5.33 2.79,10.67 5.08,12.95 8.38,12.95 8.89,13.46 v8.89,21.84

### Text on the board
tPlace: RESET | MODE | + | - | VBUS
bPlace: SomTest1 / v3